# Altium schematic sheet 01_MAIN.SchDoc: =GlobalProjectName
size 410 x 297 mm; CheckedBy: A_D; Author: A_D; SheetNumber: 1; SheetTotal: 3; PageSetup: Record=PageOptions|CenterHorizontal=True|CenterVertical=True|PrintScale=0.70|XCorrection=1.00|YCorrection=1.00|PrintKind=2|BorderSize=5000000|LeftOffset=9000|BottomOffset=10100|Orientation=2|PaperLength=11176|PaperWidth=8636|Scale=100|PaperSource=259|PrintQuality=-3|MediaType=1|DitherType=10|PrintScaleMode=1|PaperKind=A3|PaperIndex=8
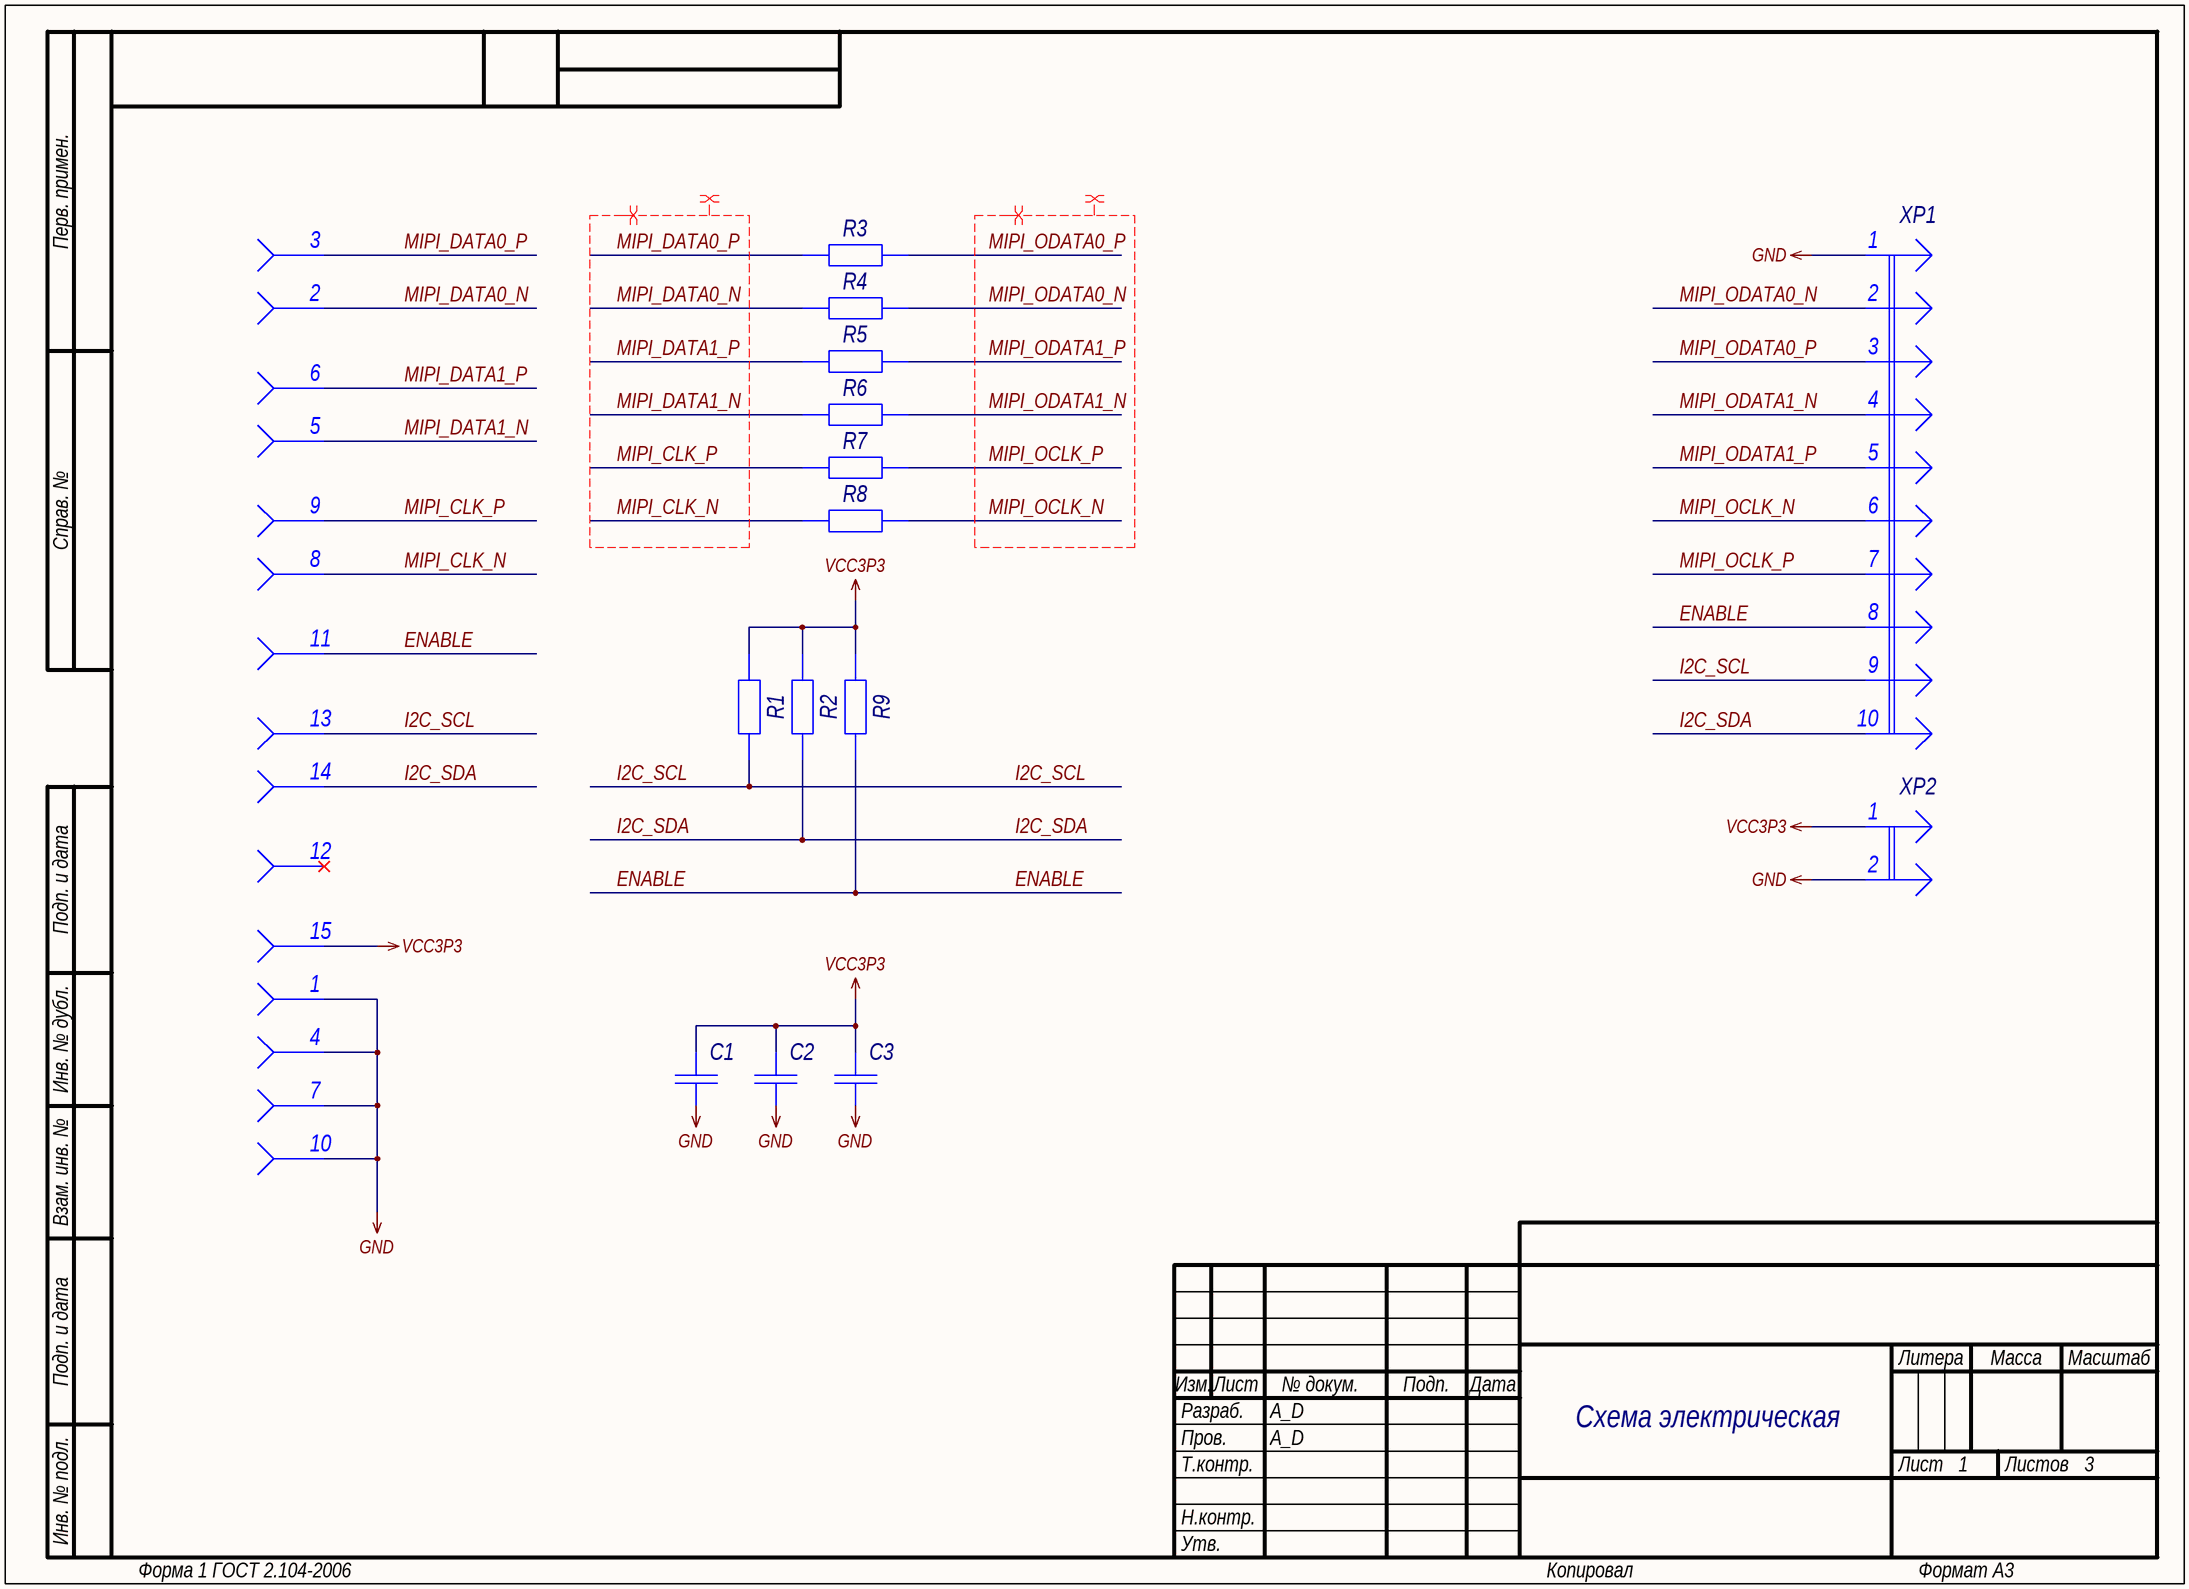
[diagram p0: 01_MAIN.SchDoc]

## Parts
C1  Capacitor  [C0603_L]  (value not drawn)
C2  Capacitor  [C0603_L]  (value not drawn)
C3  Capacitor  [C0603_L]  (value not drawn)
R1  Resistor  [R0603_L]  (value not drawn)
R2  Resistor  [R0603_L]  (value not drawn)
R3  Resistor  [R0603_L]  (value not drawn)
R4  Resistor  [R0603_L]  (value not drawn)
R5  Resistor  [R0603_L]  (value not drawn)
R6  Resistor  [R0603_L]  (value not drawn)
R7  Resistor  [R0603_L]  (value not drawn)
R8  Resistor  [R0603_L]  (value not drawn)
R9  Resistor  [R0603_L]  (value not drawn)
XP1  Text  [PLS-10]  (value not drawn)
XP2  Text  [PLS-2]  (value not drawn)
XS1  CAM  [1-84953-5]  (value not drawn)  (parts A,B,C,D,E,F,G,H,I,J,K,L,M,N,O of 15)

## Nets
GND: C1.1 C2.1 C3.1 XP1.1 XP2.2 XS1.1 XS1.4 XS1.7 XS1.10
VCC3P3: C1.2 C2.2 C3.2 R1.2 R2.2 R9.2 XP2.1 XS1.15
ENABLE: R9.1 XP1.8 XS1.11
I2C_SCL: R1.1 XP1.9 XS1.13
I2C_SDA: R2.1 XP1.10 XS1.14
MIPI_CLK_N: R8.1 XS1.8
MIPI_CLK_P: R7.1 XS1.9
MIPI_DATA0_N: R4.1 XS1.2
MIPI_DATA0_P: R3.1 XS1.3
MIPI_DATA1_N: R6.1 XS1.5
MIPI_DATA1_P: R5.1 XS1.6
MIPI_OCLK_N: R8.2 XP1.6
MIPI_OCLK_P: R7.2 XP1.7
MIPI_ODATA0_N: R4.2 XP1.2
MIPI_ODATA0_P: R3.2 XP1.3
MIPI_ODATA1_N: R6.2 XP1.4
MIPI_ODATA1_P: R5.2 XP1.5

Not connected (* = marked no-connect by the designer): XS1 12*

## Layout directives
differential pair: MIPI_CLK_N, MIPI_CLK_P, MIPI_DATA0_N, MIPI_DATA0_P, MIPI_DATA1_N, MIPI_DATA1_P, MIPI_OCLK_N, MIPI_OCLK_P, MIPI_ODATA0_N, MIPI_ODATA0_P, MIPI_ODATA1_N, MIPI_ODATA1_P
rule Matched Net Lengths [Tolerance = 1mm]; rule Differential Pairs Routing [Pref Gap = 0.152mm    Min Gap  = 0.152mm    Max Gap  = 0.152mmPref Width = 0.4mm    Min Width  = 0.4mm    Max Width  = 0.4mm]: MIPI_CLK_N, MIPI_CLK_P, MIPI_DATA0_N, MIPI_DATA0_P, MIPI_DATA1_N, MIPI_DATA1_P, MIPI_OCLK_N, MIPI_OCLK_P, MIPI_ODATA0_N, MIPI_ODATA0_P, MIPI_ODATA1_N, MIPI_ODATA1_P

## Notes on the sheet
- Схема электрическая
  принципиальная
- Перв. примен.
- Справ. №
- Подп. и дата
- Инв. № дубл.
- Взам. инв. №
- Разраб.
- Изм.
- Лист
- № докум.
- Подп.
- Дата
- Литера
- Масса
- Масштаб
- Пров.
- Т.контр.
- Листов
- Инв. № подл.
- Н.контр.
- Утв.
- Форма 1 ГОСТ 2.104-2006
- Копировал
- Формат А3

## Library data of the parts
C1 = GRM188R61A106KE69D: Manufacturer: Murata; Type: Конденсатор; ID: 173; Value: 10uF; Voltage: 10V; Tolerance: ±10%; Dielectric Type: X5R; Application Category: 1; Working Temperature Min: -55°С; Working Temperature Max: +85°С; Published: 18.05.2010; Publisher: Andrew Danich; Part Number: GRM188R61A106KE69D; Footprint: 0603
C2 = GRM188R72A104KA35D: Manufacturer: Murata; Type: Конденсатор; ID: 232; Value: 0.1uF; Voltage: 100V; Tolerance: ±10%; Dielectric Type: X7R; Application Category: 1; Working Temperature Min: -55°С; Working Temperature Max: +125°С; Published: 18.05.2010; Publisher: Andrew Danich; Part Number: GRM188R72A104KA35D; Footprint: 0603
C3 = GRM1885C2A102JA01D: Manufacturer: Murata; Type: Конденсатор; ID: 135; Value: 1000pF; Voltage: 100V; Tolerance: ±5%; Dielectric Type: NP0; Application Category: 1; Working Temperature Min: -55°С; Working Temperature Max: +125°С; Published: 18.05.2010; Publisher: Andrew Danich; Part Number: GRM1885C2A102JA01D; Footprint: 0603
R1 R2 R9 = RC0603JR-074K7L: Manufacturer: Yageo; ID: 56; Value: 4.7k; Limit Voltage: 50V; Tolerance: ±5%; Temperature Coefficient: 100ppm; Total Power Dissipation: 0.1W; Series Type: Thick-Film; Application Category: 1; Working Temperature Min: -55°С; Working Temperature Max: +155°С; Published: 24.03.2010; Publisher: Andrew Danich; Type: Резистор; Part Number: RC0603JR-074K7L; Footprint: 0603
R3-R8 = RC0603JR-070R: Manufacturer: Yageo; ID: 5; Value: 0; Limit Voltage: 50V; Tolerance: ±5%; Temperature Coefficient: 100ppm; Total Power Dissipation: 0.1W; Series Type: Thick-Film; Application Category: 1; Working Temperature Min: -55°С; Working Temperature Max: +155°С; Functional Analog: RC0603FR-070RL, CR0603-J/-000E; Published: 24.03.2010; Publisher: Andrew Danich; Type: Резистор; Part Number: RC0603JR-070R; Footprint: 0603
XP1 = PLS-10: Value: PLS-10; ID: 9; Limit Voltage: 250V; Limit Current: 3A; Connector Type: Male; Resistance: 15momh; Surface Finish: Gold; Pitch: 2.54mm; Application Category: 1; Published: 07.03.2013; Publisher: Andrew Danich; Type: Вилка; Part Number: PLS-10; Pins: 10
XP2 = PLS-2: Value: PLS-2; ID: 1; Limit Voltage: 250V; Limit Current: 3A; Connector Type: Male; Resistance: 15momh; Surface Finish: Gold; Pitch: 2.54mm; Published: 07.03.2013; Publisher: Andrew Danich; Type: Вилка; Part Number: PLS-2; Pins: 2; Application Category: 1
XS1 = 1-84953-5: Manufacturer: TE Connectivity; ID: 2; Limit Voltage: 200V; Limit Current: 1A; Connector Type: Female; Pitch: 1mm; Application Category: 1; Working Temperature Min: -40°С; Working Temperature Max: +85°С; Published: 17.09.2018; Publisher: Andrew Danich; Type: Розетка; Part Number: 1-84953-5; Value: 1-84953-5; Pins: 15; Series: FPC